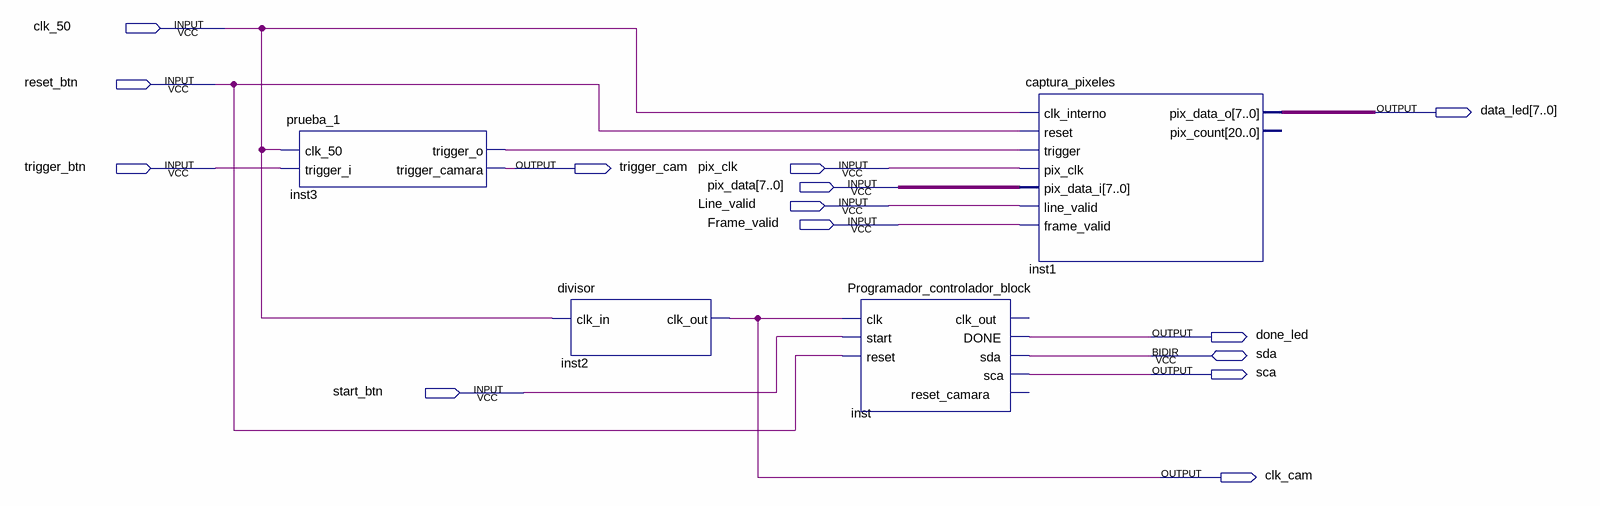
[diagram p0: schematic sheet]
// Quartus schematic signal_tap.bdf as structural Verilog: 4 symbols, 14 pins
module signal_tap (
  input  clk_50,
  input  reset_btn,
  input  trigger_btn,
  input  pix_clk,
  input  [7:0] pix_data,
  input  Line_valid,
  input  Frame_valid,
  input  start_btn,
  inout  sda,
  output [7:0] data_led,
  output trigger_cam,
  output done_led,
  output sca,
  output clk_cam
);

  wire inst3_trigger_o;

  prueba_1 inst3 (.clk_50(clk_50), .trigger_i(trigger_btn), .trigger_o(inst3_trigger_o), .trigger_camara(trigger_cam));
  divisor inst2 (.clk_in(clk_50), .clk_out(clk_cam));
  Programador_controlador_block inst (
    .clk(clk_cam), .start(start_btn), .reset(reset_btn), .DONE(done_led), .sca(sca), .sda(sda));  // open: clk_out, reset_camara
  captura_pixeles inst1 (
    .clk_interno(clk_50), .reset(reset_btn), .trigger(inst3_trigger_o), .pix_clk(pix_clk),
    .pix_data_i(pix_data), .line_valid(Line_valid), .frame_valid(Frame_valid), .pix_data_o(data_led));  // open: pix_count
endmodule
